# EasyEDA Pro project SAKANA_PCB.epro

# Schematic INA219
Board Name: INA219; Create Date: 2024-12-30; Page Name: P1; Project Name: SAKANA; Schematic Name: INA219; Update Date: 2024-12-30; Company: BSJ INSTRUMENT; Page Size: A5; Version: V1.0
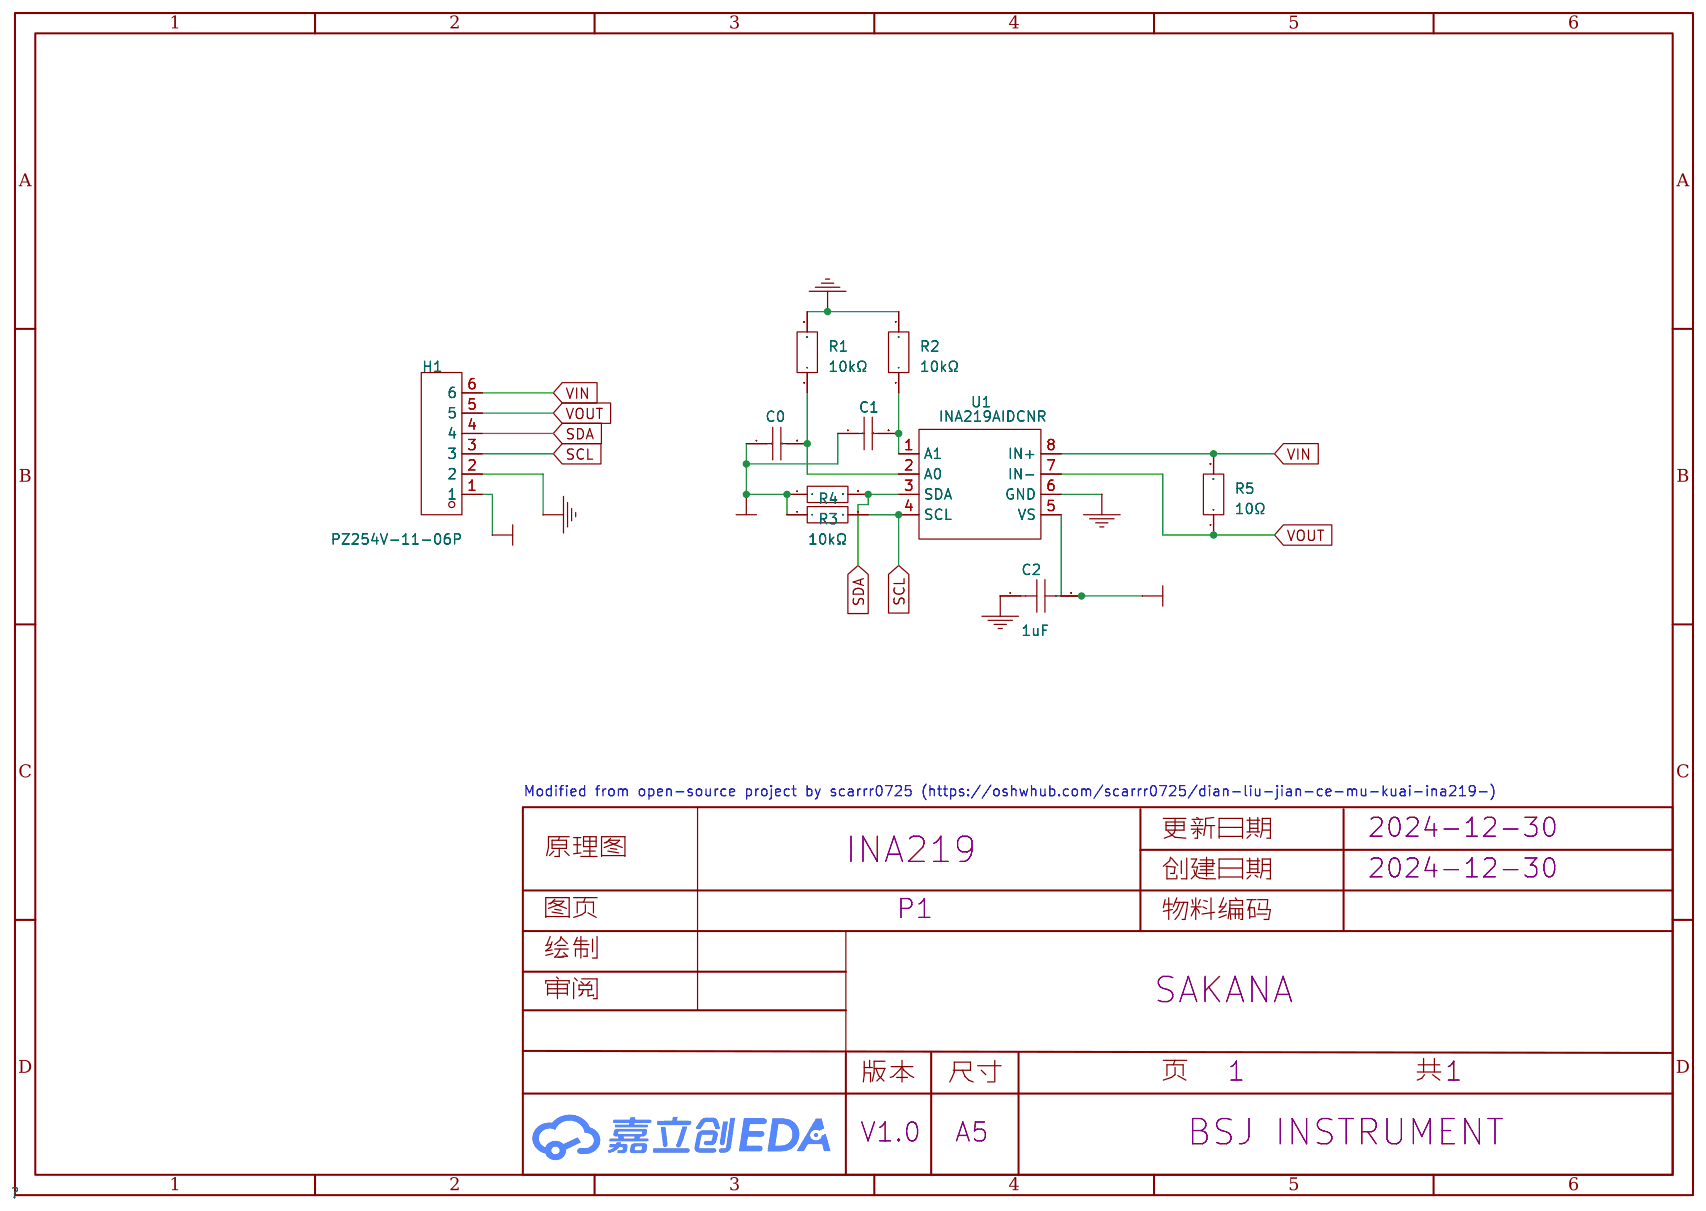
[diagram p0: schematic sheet]

## Parts
C0  1uF  [CAP-TH_L8.5-W5.0-P5.00-D1.2]
C1  1uF  [CAP-TH_L8.5-W5.0-P5.00-D1.2]
C2  1uF  [CAP-TH_L8.5-W5.0-P5.00-D1.2]
H1  PZ254V-11-06P  [HDR-TH_6P-P2.54-V-M]
R1  10kΩ  [RES-TH_BD2.7-L6.2-P10.20-D0.4]
R2  10kΩ  [RES-TH_BD2.7-L6.2-P10.20-D0.4]
R3  10kΩ  [RES-TH_BD2.7-L6.2-P10.20-D0.4]
R4  10K  [RES-TH_BD2.7-L6.2-P10.20-D0.4]
R5  10Ω  [RES-TH_BD2.7-L6.2-P10.20-D0.4]
U1  INA219AIDCNR  [SOIC-8_L4.9-W3.9-P1.27-LS6.0-BL]

## Library data of the parts
C0 C1 = 1uF: Supplier: LCSC; Manufacturer Part: CL10A105KB8NNNC; Manufacturer: SAMSUNG; Supplier Part: C15849; JLCPCB Part Class: Basic
C2 = CT4-0805B104K500F3: 容值:100nF;精度:±10%;额定电压:50V;温度系数:X7R;; LCSC Part Name: 100nF ±10% 50V C3型（直脚）; Supplier Part: C84772; Manufacturer: FH(风华); Supplier Footprint: 插件,P=5.08mm; JLCPCB Part Class: 扩展库; Datasheet: https://atta.szlcsc.com/upload/public/pdf/source/20190402/C385200_059806A6312B28FF1421A2413EB641E1.pdf; Supplier: LCSC; Tolerance: ±10%; Voltage Rated: 50V; Temperature Coefficient: X7R
H1 = PZ254V-11-06P: 插针结构:1x6P;间距:2.54mm;行距:-;圆针/方针:方针;安装类型:直插;排数:单排;总PIN位数:6P;额定电流:-;额定电压:-;配合针长度:6mm;塑高:2.5mm;端接针长度:3mm;触头材质:黄铜;触头镀层:-;工作温度范围:-40℃~+105℃;颜色:黑色;; LCSC Part Name: 间距:2.54mm 1x6P 直插 方针; Supplier Part: C492405; Manufacturer: XFCN(兴飞); Supplier Footprint: 插件,P=2.54mm; JLCPCB Part Class: 扩展库; Datasheet: https://atta.szlcsc.com/upload/public/pdf/source/20200309/C492405_597F1930F5B55CC3C7FD95458F1C3977.pdf; Supplier: LCSC; Pin Structure: 1x6P; Pitch: 2.54mm; Circluar Pins/Square Pins: 方针; Mounting Type: 直插; Number of Rows: 单排; Number of Pins: 6P; Length of Mating Pin: 6mm; Insulation Height: 2.5mm; Length of End Connection Pin: 3mm; Contact Material: 黄铜; Operating Temperature Range: -40℃~+105℃; Color: 黑色
R1 R2 R5 = MF1/4W-1K±1%-ST52: 电阻类型:金属膜电阻;阻值:1kΩ;精度:±1%;功率:250mW;温度系数:±100ppm/℃;; LCSC Part Name: 金属膜电阻 1kΩ ±1% 250mW; Supplier Part: C2903245; Manufacturer: VO(翔胜); Supplier Footprint: 插件,D2.7xL6.2mm; JLCPCB Part Class: 扩展库; Datasheet: https://atta.szlcsc.com/upload/public/pdf/source/20200609/C601728_5AA4C0C8E12E11069DA2C3356F29D1F2.pdf; Supplier: LCSC; Type: 金属膜电阻; Tolerance: ±1%; Overload Voltage (Max): 250V; Power(Watts): 250mW; Temperature Coefficient: ±100ppm/℃; Operating Temperature Range: -55℃~+155℃
R3 R4 = 10K: Supplier: LCSC; Manufacturer Part: TC0325B1002T5E; Manufacturer: UniOhm; Supplier Part: C39050; JLCPCB Part Class: Extend
U1 = INA219AIDCNR: Supplier: LCSC; Manufacturer: TI; Supplier Part: C87469; JLCPCB Part Class: Extend

## Nets
+5V: C0.1 C1.1 C2.2 H1.1 R3.1 R4.1 U1.5(VS)
GND: C2.1 H1.2 R1.2 R2.2 U1.6(GND)
VIN: H1.6 R5.2 U1.8(IN+)
SCL: H1.3 R3.2 U1.4(SCL)
SDA: H1.4 R4.2 U1.3(SDA)
VOUT: H1.5 R5.1 U1.7(IN-)
Net-(C0-2): C0.2 R1.1 U1.2(A0)
Net-(C1-2): C1.2 R2.1 U1.1(A1)

## Notes on the sheet
- Modified from open-source project by scarrr0725 (https://oshwhub.com/scarrr0725/dian-liu-jian-ce-mu-kuai-ina219-)

# Schematic Main
Board Name: Main; Create Date: 2024-12-29; Page Name: P1; Project Name: SAKANA; Schematic Name: Main; Update Date: 2025-02-09; Company: BSJ INSTRUMENT; Page Size: A4; Version: V1.0
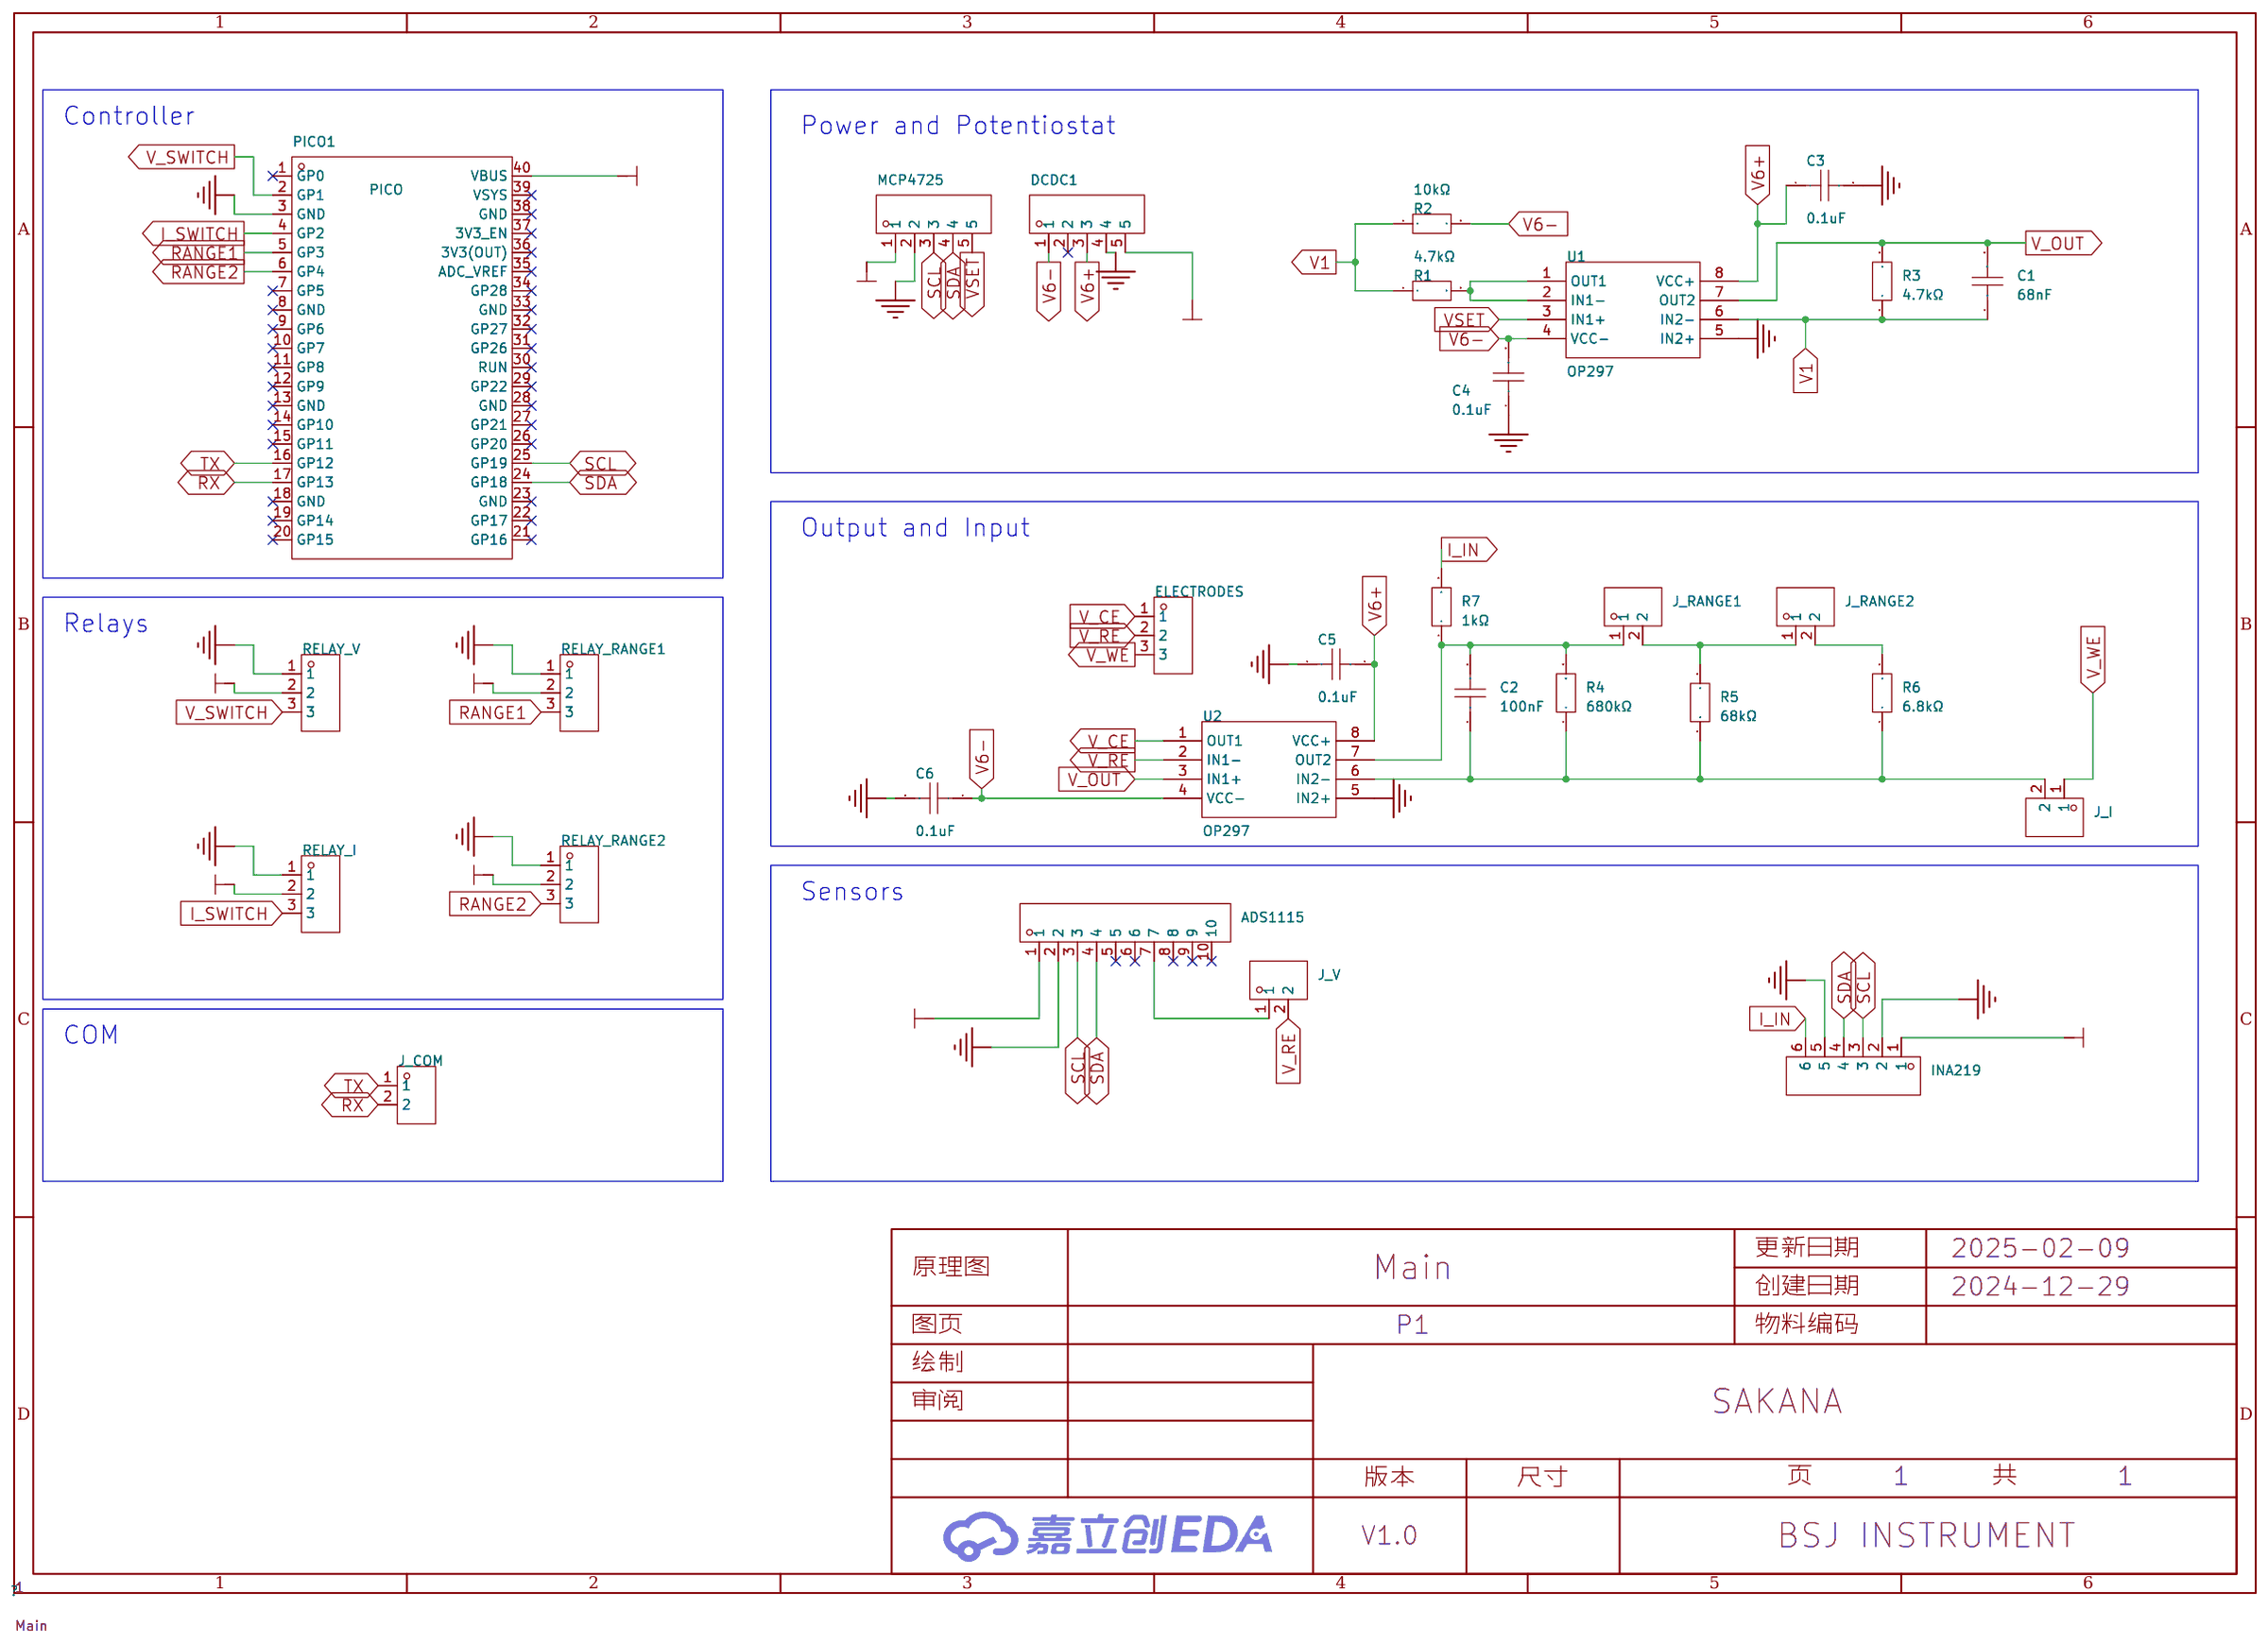
[diagram p1: schematic sheet]

## Parts
ADS1115  HDR1X10  [ADS1115Module]
C1  68nF  [CAP-TH_L10.0-W2.5-P5.15-D0.8]
C2  100nF  [CAP-TH_L10.0-W2.5-P5.15-D0.8]
C3  0.1uF  [CAP-TH_L10.0-W2.5-P5.15-D0.8]
C4  0.1uF  [CAP-TH_L10.0-W2.5-P5.15-D0.8]
C5  0.1uF  [CAP-TH_L10.0-W2.5-P5.15-D0.8]
C6  0.1uF  [CAP-TH_L10.0-W2.5-P5.15-D0.8]
DCDC1  PZ254V-11-05P  [DCDCModule]
ELECTRODES  排母2.54mm 1X3pin  [HDR-TH_3P-P2.54_CS-1165SDIG]
INA219  KH-2.54FH90-1X6P-H8.5  [INA219Module]
J_COM  HDR1X2  [HDR-TH_2P-P2.54-V-M-1]
J_I  HDR1X2  [HDR-TH_2P-P2.54-V-M-1]
J_RANGE1  HDR1X2  [HDR-TH_2P-P2.54-V-M-1]
J_RANGE2  HDR1X2  [HDR-TH_2P-P2.54-V-M-1]
J_V  HDR1X2  [HDR-TH_2P-P2.54-V-M-1]
MCP4725  PZ254V-11-05P  [MCP4725Module]
PICO1  PICO  [PICO直插]
R1  4.7kΩ  [RES-TH_BD2.7-L6.2-P10.20-D0.4]
R2  10kΩ  [RES-TH_BD2.7-L6.2-P10.20-D0.4]
R3  4.7kΩ  [RES-TH_BD2.7-L6.2-P10.20-D0.4]
R4  680kΩ  [RES-TH_BD2.7-L6.2-P10.20-D0.4]
R5  68kΩ  [RES-TH_BD2.7-L6.2-P10.20-D0.4]
R6  6.8kΩ  [RES-TH_BD2.7-L6.2-P10.20-D0.4]
R7  1kΩ  [RES-TH_BD2.7-L6.2-P10.20-D0.4]
RELAY_I  排母2.54mm 1X3pin  [RELAYModule]
RELAY_RANGE1  排母2.54mm 1X3pin  [RELAYModule]
RELAY_RANGE2  排母2.54mm 1X3pin  [RELAYModule]
RELAY_V  排母2.54mm 1X3pin  [RELAYModule]
U1  OP297  [PDIP-8_L9.6-W6.4-P2.54-LS7.6-BL-1]
U2  OP297  [PDIP-8_L9.6-W6.4-P2.54-LS7.6-BL-1]

## Library data of the parts
ADS1115 = HDR1X10: Supplier Part: C9900008052; Supplier Footprint: 1X10P2.54mm塑高3.5mm; JLCPCB Part Class: 扩展库; Supplier: LCSC
C1-C6 = CC1H104ZA1FD3F6C1100: 容值:100nF;精度:-20%~+80%;额定电压:50V;温度系数:Y5V;; LCSC Part Name: 100nF -20%~+80% 50V; Supplier Part: C5442939; Manufacturer: Dersonic(德尔创); Supplier Footprint: 插件,P=2.54mm; JLCPCB Part Class: 扩展库; Datasheet: https://atta.szlcsc.com/upload/public/pdf/source/20240808/2E4F22AECAD8A963CB56DA9A5AABDB6C.pdf; Supplier: LCSC; Tolerance: -20%~+80%; Voltage Rated: 50V; Lead Spacing: 2.54mm; Temperature Coefficient: Y5V; Diameter: 6.3mm; Body Thickness: 2.6mm
DCDC1 MCP4725 = PZ254V-11-05P: 插针结构:1x5P;间距:2.54mm;行距:-;圆针/方针:方针;安装类型:直插;排数:单排;总PIN位数:5P;额定电流:-;额定电压:-;配合针长度:6mm;塑高:2.5mm;端接针长度:3mm;触头材质:黄铜;触头镀层:-;工作温度范围:-40℃~+105℃;颜色:黑色;; LCSC Part Name: 间距:2.54mm 1x5P 直插 方针; Supplier Part: C492404; Manufacturer: XFCN(兴飞); Supplier Footprint: 插件,P=2.54mm; JLCPCB Part Class: 扩展库; Datasheet: https://atta.szlcsc.com/upload/public/pdf/source/20200309/C492404_E51533260F8710EFF5D4617281164C1D.pdf; Supplier: LCSC; Pin Structure: 1x5P; Pitch: 2.54mm; Circluar Pins/Square Pins: 方针; Mounting Type: 直插; Number of Rows: 单排; Number of Pins: 5P; Length of Mating Pin: 6mm; Insulation Height: 2.5mm; Length of End Connection Pin: 3mm; Contact Material: 黄铜; Operating Temperature Range: -40℃~+105℃; Color: 黑色
ELECTRODES RELAY_I RELAY_RANGE1 RELAY_RANGE2 RELAY_V = 排母2.54mm 1X3pin: Supplier Part: C9900016709; JLCPCB Part Class: 扩展库; Supplier: LCSC
INA219 = KH-2.54FH90-1X6P-H8.5: 插孔结构:1x6P;间距:2.54mm;行距:-;圆孔/方孔:方孔;安装类型:弯插;排数:单排;总孔位数:6P;额定电流:3A;额定电压:-;插孔方向:侧面;塑高:8.5mm;工作温度范围:-40℃~+105℃;; LCSC Part Name: 间距:2.54mm 1x6P 弯插; Supplier Part: C2932681; Manufacturer: kinghelm(金航标); Supplier Footprint: 弯插,P=2.54mm; JLCPCB Part Class: 扩展库; Datasheet: https://atta.szlcsc.com/upload/public/pdf/source/20211220/525C1B6496826BAEA2630695935DC58D.pdf; Supplier: LCSC; Holes Structure: 1x6P; Pitch: 2.54mm; Circular Hole / Square Hole: 方孔; Mounting Type: 弯插; Number of Rows: 单排; Number of Holes: 6P; Current Rating (Max): 3A; Holes Direction: 侧面; Insulation Height: 8.5mm; Operating Temperature Range: -40℃~+105℃
J_COM J_I J_RANGE1 J_RANGE2 J_V = HDR1X2: Supplier Part: C9900014921; Supplier Footprint: 排针; JLCPCB Part Class: 扩展库; Supplier: LCSC
PICO1 = PICO: "基于Raspberry Pi RP2040芯片设计；处理器：双核Arm Cortex-M0+ @ 133MHz内存：264KB片上SRAM；2MB板上QSPI闪存接口：26个GPIO引脚，包括3个模拟输入；2 × UART；2 × SPI控制器；2 × I2C控制器；16个PWM通道；1 × USB 1.1控制器和PHY，支持主机和设备；8 × PIO状态机"; Supplier Part: C7203002; Manufacturer: Raspberry Pi(树莓派); JLCPCB Part Class: 扩展库; Datasheet: https://atta.szlcsc.com/upload/public/pdf/source/20230906/086376002DDC9866828648BC93E51F8B.pdf; Supplier: LCSC
R1-R7 = MF1/4W-1K±1%-ST52: 电阻类型:金属膜电阻;阻值:1kΩ;精度:±1%;功率:250mW;温度系数:±100ppm/℃;; LCSC Part Name: 金属膜电阻 1kΩ ±1% 250mW; Supplier Part: C2903245; Manufacturer: VO(翔胜); Supplier Footprint: 插件,D2.7xL6.2mm; JLCPCB Part Class: 扩展库; Datasheet: https://atta.szlcsc.com/upload/public/pdf/source/20200609/C601728_5AA4C0C8E12E11069DA2C3356F29D1F2.pdf; Supplier: LCSC; Type: 金属膜电阻; Tolerance: ±1%; Overload Voltage (Max): 250V; Power(Watts): 250mW; Temperature Coefficient: ±100ppm/℃; Operating Temperature Range: -55℃~+155℃
U1 U2 = NE5532PE4: 放大器数:双路;增益带宽积(GBP):10MHz;输入偏置电流(Ib):200nA;压摆率(SR):9V/us;带宽(-3db):-;; Supplier Part: C1347122; Manufacturer: TI(德州仪器); Supplier Footprint: PDIP-8; JLCPCB Part Class: 扩展库; Datasheet: https://www.ti.com/cn/lit/gpn/sa5532; Supplier: LCSC; Number of Circuits: 双路; Gain Bandwidth Product(GBP): 10MHz; Current - Input Bias(Ib): 200nA; Slew Rate(SR): 9V/us; Output Current: 38mA; Operating Temperature: 0℃~+70℃

## Nets
GND: ADS1115.2 C3.2 C4.1 C5.2 C6.2 DCDC1.4 INA219.2 INA219.5 MCP4725.2 PICO1.3(GND) RELAY_I.1 RELAY_RANGE1.1 RELAY_RANGE2.1 RELAY_V.1 U1.5(IN2+) U2.5(IN2+)
V1: C1.1 R1.1 R2.1 R3.1 U1.6(IN2-)
V6+: C3.1 C5.1 DCDC1.3 U1.8(VCC+) U2.8(VCC+)
V6-: C4.2 C6.1 DCDC1.1 R2.2 U1.4(VCC-) U2.4(VCC-)
VCC: ADS1115.1 DCDC1.5 INA219.1 MCP4725.1 PICO1.40(VBUS) RELAY_I.2 RELAY_RANGE1.2 RELAY_RANGE2.2 RELAY_V.2
I_IN: INA219.6 R7.2
I_SWITCH: PICO1.4(GP2) RELAY_I.3
RANGE1: PICO1.5(GP3) RELAY_RANGE1.3
RANGE2: PICO1.6(GP4) RELAY_RANGE2.3
RX: J_COM.2 PICO1.17(GP13)
SCL: ADS1115.3 INA219.3 MCP4725.3 PICO1.25(GP19)
SDA: ADS1115.4 INA219.4 MCP4725.4 PICO1.24(GP18)
TX: J_COM.1 PICO1.16(GP12)
V_CE: ELECTRODES.1 U2.1(OUT1)
V_OUT: C1.2 R3.2 U1.7(OUT2) U2.3(IN1+)
V_RE: ELECTRODES.2 J_V.2 U2.2(IN1-)
V_SWITCH: PICO1.2(GP1) RELAY_V.3
V_WE: ELECTRODES.3 J_I.1
VSET: MCP4725.5 U1.3(IN1+)
$1N2928: R1.2 U1.1(OUT1) U1.2(IN1-)
$1N3893: C2.1 J_I.2 R4.1 R5.2 R6.1 U2.6(IN2-)
$1N3984: C2.2 J_RANGE1.1 R4.2 R7.1 U2.7(OUT2)
$1N5030: ADS1115.7 J_V.1
$1N11195: J_RANGE1.2 J_RANGE2.1 R5.1
$1N11201: J_RANGE2.2 R6.2

Not connected (* = marked no-connect by the designer): ADS1115 5* 6* 8* 9* 10*; DCDC1 2*; PICO1 1(GP0)* 7(GP5)* 8(GND)* 9(GP6)* 10(GP7)* 11(GP8)* 12(GP9)* 13(GND)* 14(GP10)* 15(GP11)* 18(GND)* 19(GP14)* 20(GP15)* 21(GP16)* 22(GP17)* 23(GND)* 26(GP20)* 27(GP21)* 28(GND)* 29(GP22)* 30(RUN)* 31(GP26)* 32(GP27)* 33(GND)* 34(GP28)* 35(ADC_VREF)* 36(3V3(OUT))* 37(3V3_EN)* 38(GND)* 39(VSYS)*

## Notes on the sheet
- Controller
- Power and Potentiostat
- Output and Input
- Relays
- Sensors
- COM

# Board PCB1_1
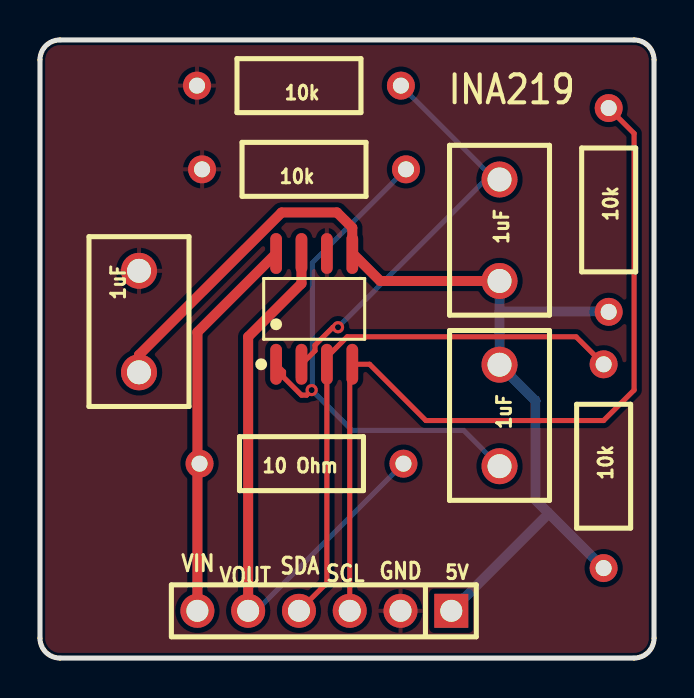
[diagram p2: board, top side]
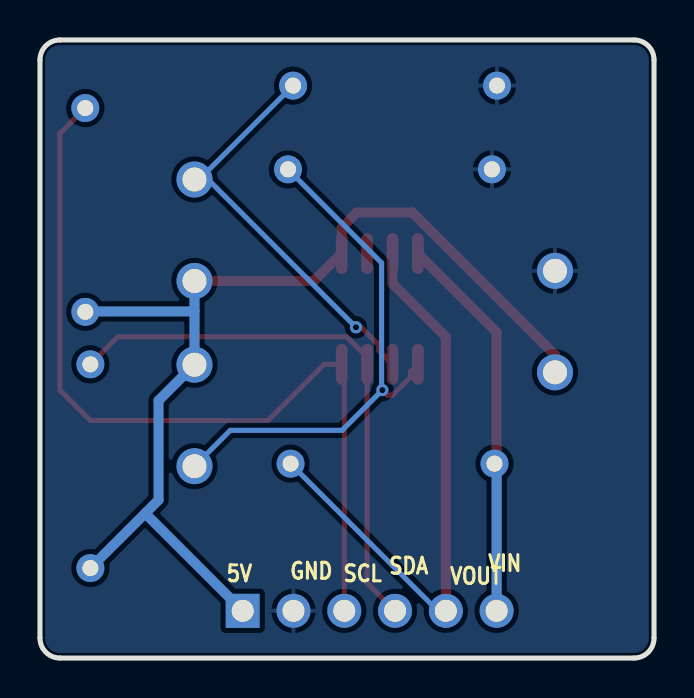
[diagram p3: board, bottom side, seen from below]

Outline 30.72 x 30.94 mm; copper layers: Top Layer, Bottom Layer. Coordinates in mm from the lower left corner of the outline.
Outline path: 0,29.94 0,1 arc(0.29,0.29) 1,0 29.72,0 arc(30.42,0.29) 30.72,1 30.72,29.94 arc(30.42,30.65) 29.72,30.94 1,30.94 arc(0.29,30.65) 0,29.94
Stack: Top Layer 0.035mm / Dielectric1 1.51mm FR4 er 4.5 / Bottom Layer 0.035mm

## Design rules (mm)
template: JLCPCB Capability(Two Layers Board)
spacing copperThickness1oz (default): track to track 0.102, other pairs 0.152 to 0.3
spacing copperThickness2oz: track to track 0.203, other pairs 0.152 to 0.3
track width copperThickness1oz (default): min 0.127, default 0.254, max 2.54
track width copperThickness2oz: min 0.203, default 0.254, max 2.54
differential pair differentialPair (default): width min 0.127, default 0.254, max 2.54; gap min 0.152, default 0.152
via viaSize (default): diameter min 0.5, default 0.61, max 10; hole min 0.3, default 0.305, max 6.3

## Placement (name value [footprint] x y rotation side)
1uF  -  [CAP-TH_L8.5-W5.0-P5.00-D1.2]  22.99 21.41 90 top
1uF#2  -  [CAP-TH_L8.5-W5.0-P5.00-D1.2]  22.99 12.14 270 top
1uF#3  -  [CAP-TH_L8.5-W5.0-P5.00-D1.2]  4.95 16.84 270 top
5V  PZ254V-11-06P  [HDR-TH_6P-P2.54-V-M]  14.22 2.36 180 top
10 Ohm  10Ω  [RES-TH_BD2.7-L6.2-P10.20-D0.4]  13.08 9.73 180 top
10k  -  [RES-TH_BD2.7-L6.2-P10.20-D0.4]  12.95 28.65 180 top
10k#2  -  [RES-TH_BD2.7-L6.2-P10.20-D0.4]  13.21 24.46 180 top
10k#3  -  [RES-TH_BD2.7-L6.2-P10.20-D0.4]  28.45 22.43 90 top
10k#4  -  [RES-TH_BD2.7-L6.2-P10.20-D0.4]  28.19 9.6 90 top
U1  INA219AIDCNR  [SOIC-8_L4.9-W3.9-P1.27-LS6.0-BL]  13.72 17.48 0 top

## Footprints (pads in the part's own frame, mm; a bottom-side part is the same pattern mirrored in y, then rotated)
CAP-TH_L8.5-W5.0-P5.00-D1.2
  round 1.8 hole 1.2: 1(-2.54,0) 2(2.54,0)
HDR-TH_6P-P2.54-V-M
  rect 1.7x1.7 hole 1.1: 1(-6.35,0)
  round 1.7 hole 1.1: 2(-3.81,0) 3(-1.27,0) 4(1.27,0) 5(3.81,0) 6(6.35,0)
RES-TH_BD2.7-L6.2-P10.20-D0.4
  round 1.4 hole 0.8: 1(-5.1,0) 2(5.1,0)
SOIC-8_L4.9-W3.9-P1.27-LS6.0-BL
  oval 0.588x2.045 smd: 1(-1.905,-2.772) 2(-0.635,-2.772) 3(0.635,-2.772) 4(1.905,-2.772) 5(1.905,2.772) 6(0.635,2.772) 7(-0.635,2.772) 8(-1.905,2.772)

## Nets
+5V: 1uF.1 1uF#2.1 1uF#3.2 5V.1 10k#3.1 10k#4.1 U1.5
GND: 1uF#3.1 5V.2 10k.2 10k#2.2 U1.6
VIN: 5V.6 10 Ohm.2 U1.8
SCL: 5V.3 10k#3.2 U1.4
SDA: 5V.4 10k#4.2 U1.3
VOUT: 5V.5 10 Ohm.1 U1.7
$1N4: 1uF#2.2 10k#2.1 U1.1
$1N5: 1uF.2 10k.1 U1.2

## Via types
v1: diameter 0.61, hole 0.305, Top Layer to Bottom Layer, 2 vias

## Routing (per net, layer and track width the routed paths; a pad name or vN(x,y) marks a point on that pad's centre or on a via; arc(x,y) is an arc through that point)
+5V: length 53
  Top Layer w0.5: 1uF#3.2 4.95,15.17 12.09,22.3 14.86,22.3 15.62,21.54 U1.5 15.64,20.25 17.02,18.87 22.99,18.87
  Bottom Layer w0.5: 25.41,7.29 25.41,7.2 5V.1 ; 25.41,7.29 24.78,7.91 24.78,12.89 1uF#2.1 22.99,17.35 ; 25.41,7.29 10k#4.1 ; 22.99,17.35 28.43,17.35 10k#3.1 ; 22.99,17.35 22.99,18.87
VIN: length 26.9
  Top Layer w0.5: U1.8 7.87,16.31 5V.6
  Bottom Layer w0.5: 5V.6 7.87,9.62 10 Ohm.2
SCL: length 42.9
  Top Layer w0.254: 10k#3.2 29.72,26.26 29.72,13.41 28.19,11.89 19.3,11.89 16.49,14.7 U1.4 15.49,14.58 5V.3
SDA: length 28.1
  Top Layer w0.254: 10k#4.2 26.82,16.08 15.37,16.08 14.35,15.06 U1.3 14.35,3.76 5V.4
VOUT: length 29.8
  Top Layer w0.5: 13.08,20.25 13.08,18.75 10.41,16.08 5V.5
  Bottom Layer w0.254: 5V.5 10.81,2.36 10 Ohm.1
$1N4: length 26.7
  Top Layer w0.254: v1(13.59,13.41) 13.34,13.16 13.08,13.16 12.18,14.06 12.18,14.33 U1.1
  Bottom Layer w0.254: 10k#2.1 13.63,19.78 13.63,13.37 ; 13.63,13.37 v1(13.59,13.41) ; 13.63,13.37 15.6,11.4 21.19,11.4 1uF#2.2
$1N5: length 20.4
  Top Layer w0.254: 13.08,14.7 13.76,15.38 13.76,15.66 14.65,16.56 v1(14.91,16.56)
  Bottom Layer w0.254: 1uF.2 22.75,23.95 22.53,24.18 ; 22.53,24.18 v1(14.91,16.56) ; 22.53,24.18 10k.1

## Copper pours and planes (outline as drawn; the poured copper is in the pictures)
GND on Top Layer: -1.27,32.46 32.13,32.46 32.13,-1.19 -1.27,-1.19
GND on Bottom Layer: -2.16,33.1 32.64,33.1 32.64,-2.21 -2.16,-2.21

## Text on the board
Bottom Silkscreen Layer: VIN | VOUT | SDA | SCL | GND | 5V
Top Silkscreen Layer: VIN | VOUT | SDA | SCL | GND | INA219

# Board PCB1
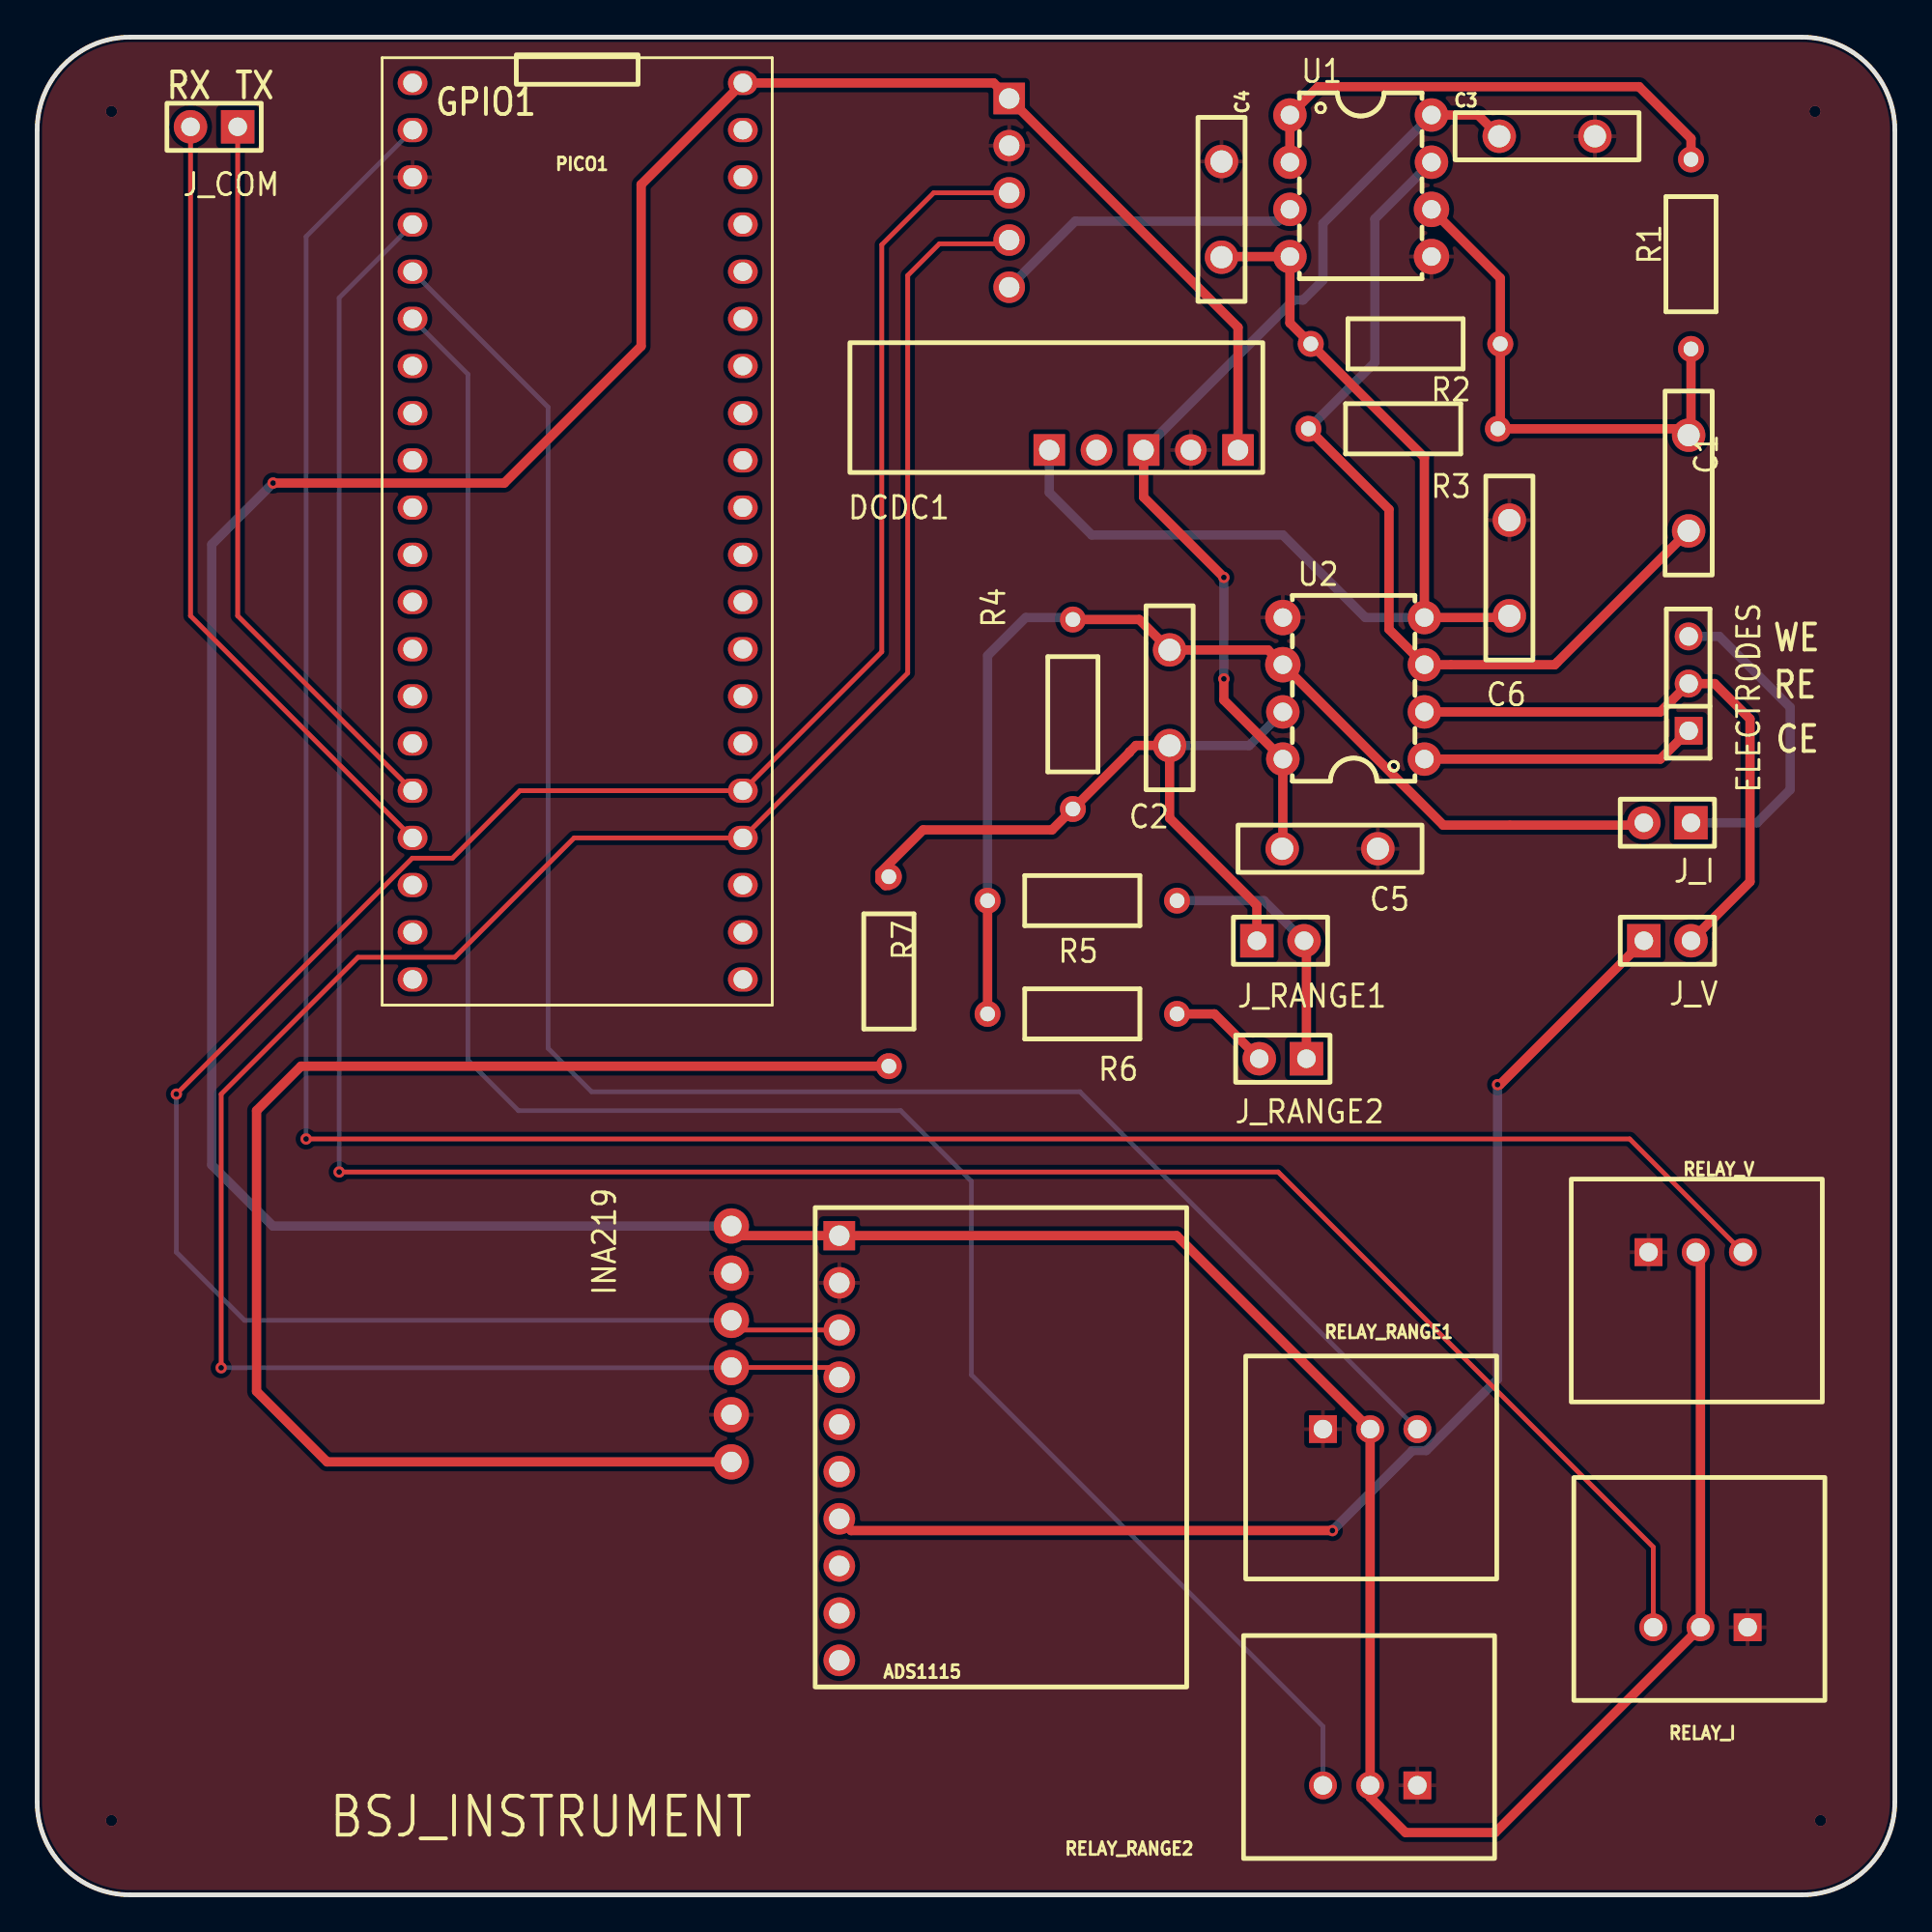
[diagram p4: board, top side]
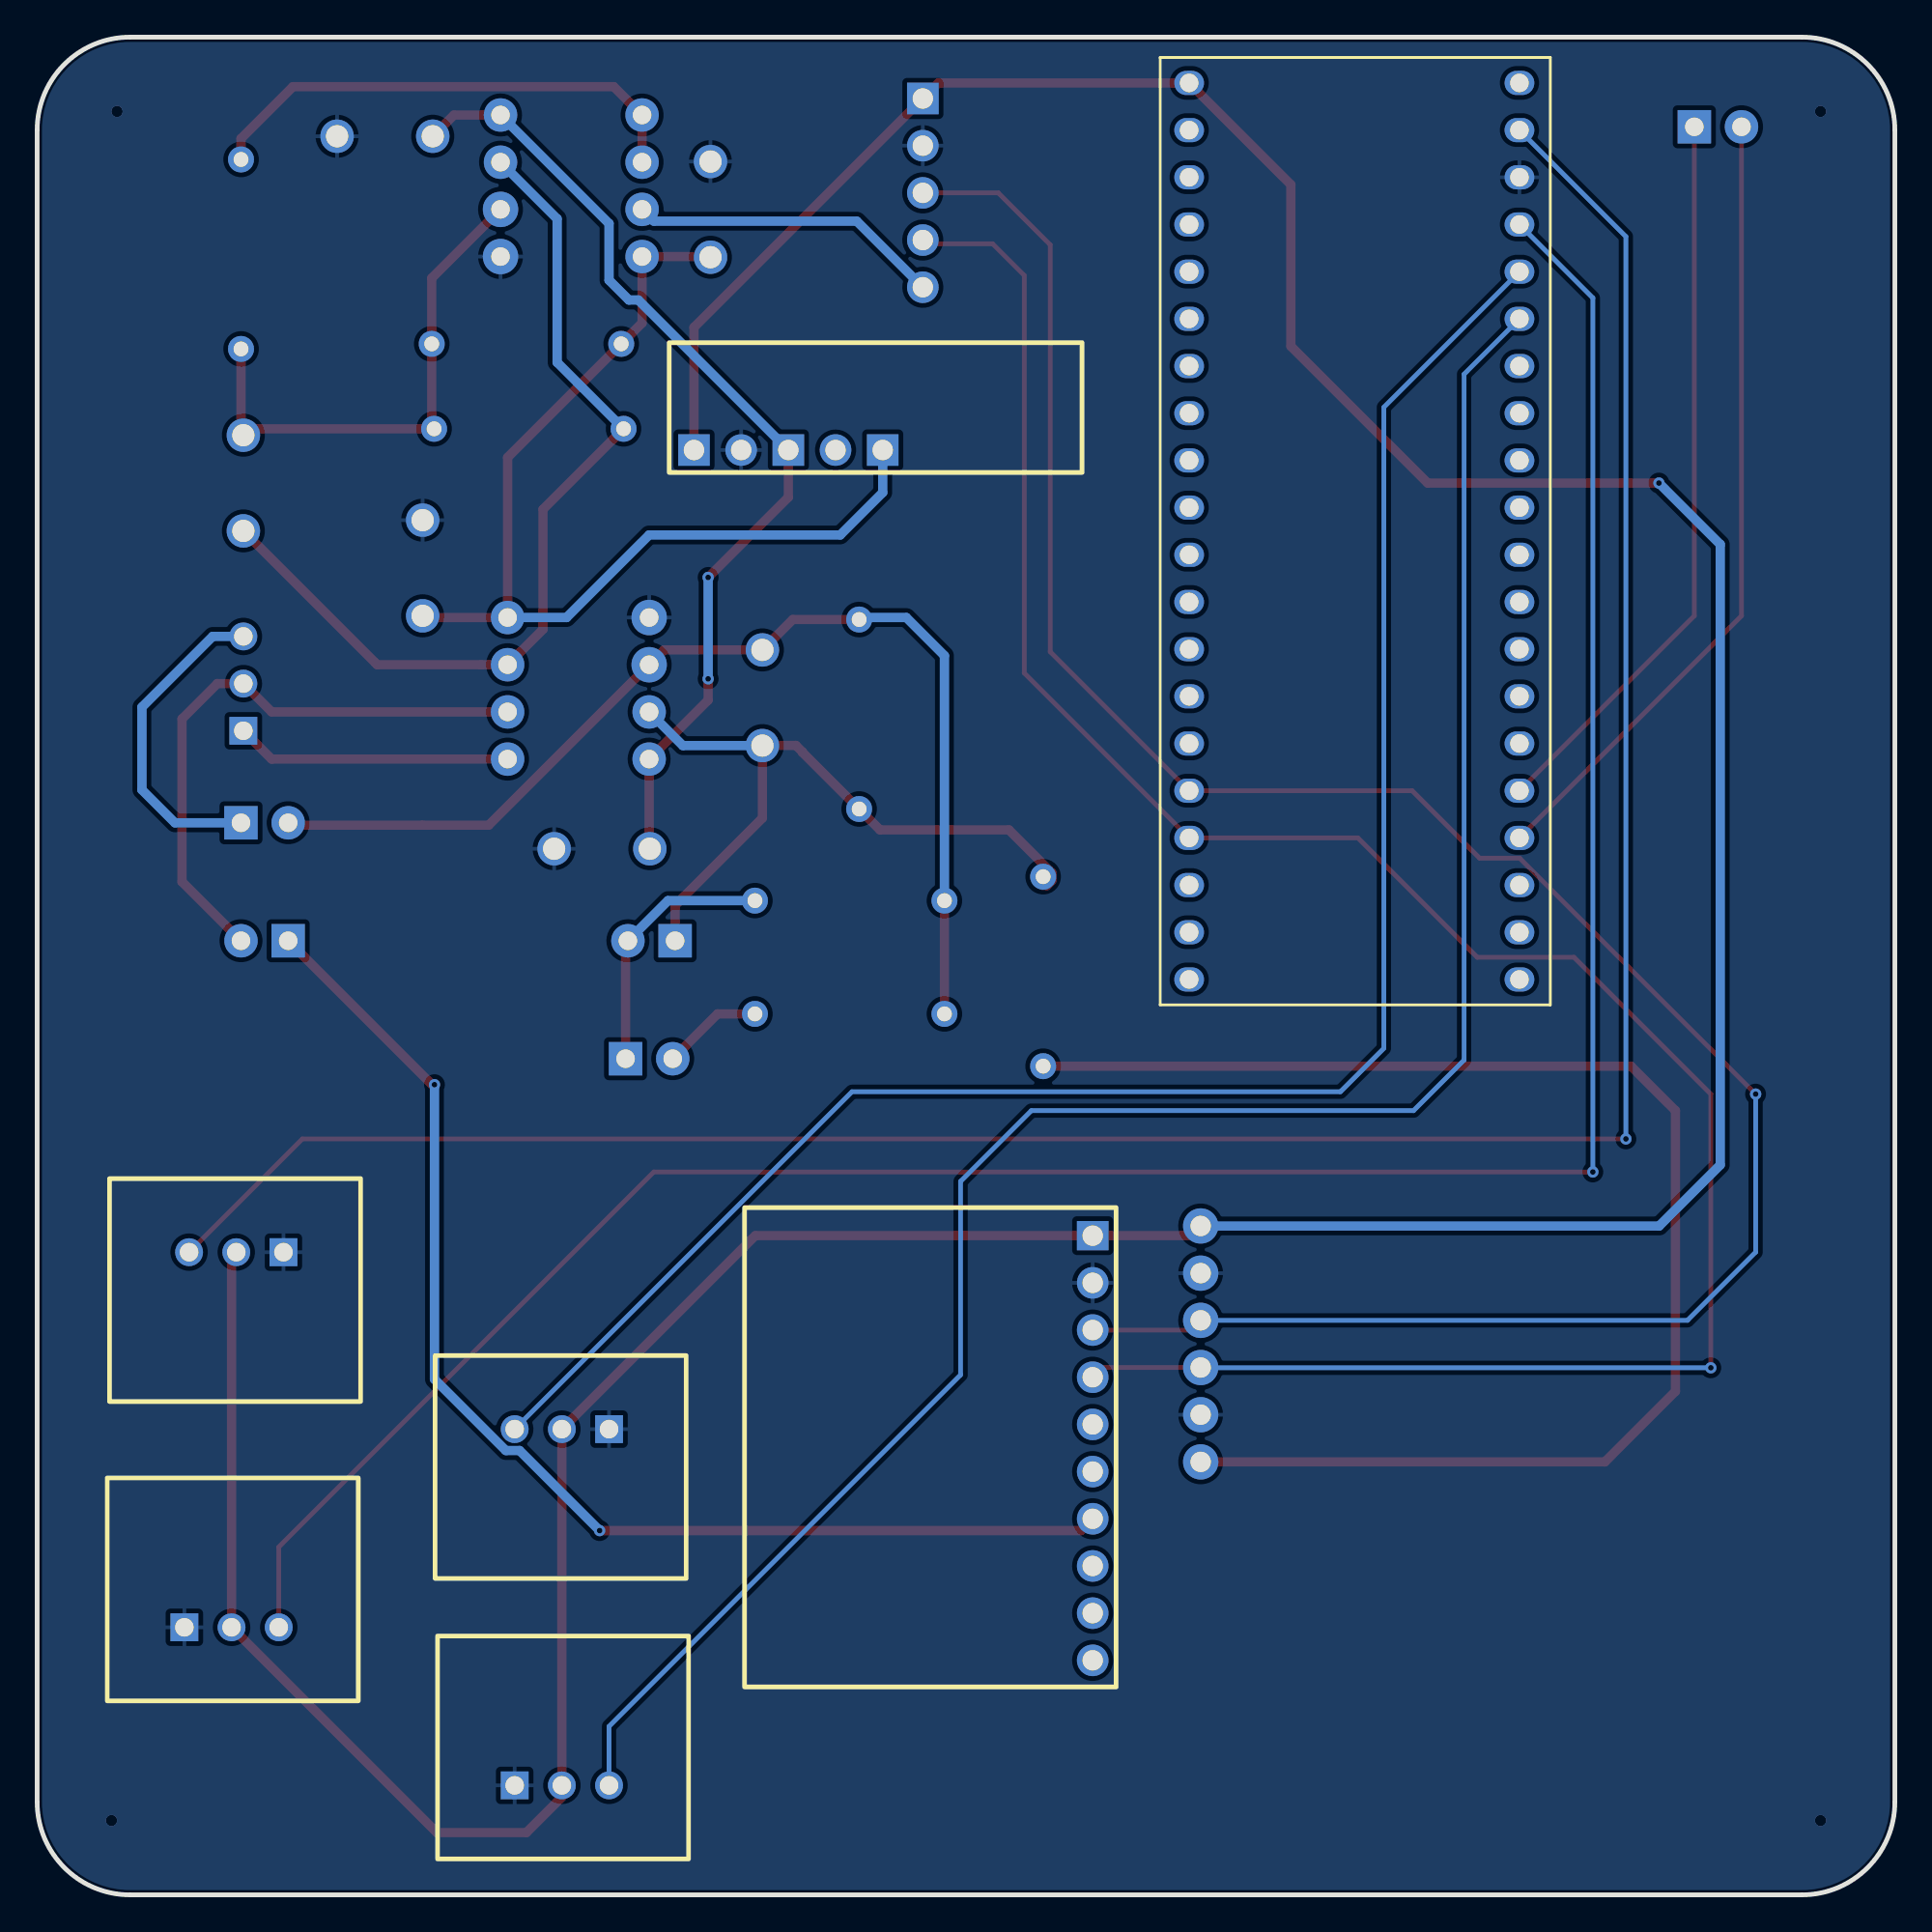
[diagram p5: board, bottom side, seen from below]

Outline 100 x 100 mm; copper layers: Top Layer, Bottom Layer. Coordinates in mm from the lower left corner of the outline.
Outline path: 0,95 0,5 arc(1.46,1.46) 5,0 95,0 arc(98.54,1.46) 100,5 100,95 arc(98.54,98.54) 95,100 5,100 arc(1.46,98.54) 0,95
Stack: Top Layer 0.035mm / Dielectric1 1.51mm FR4 er 4.5 / Bottom Layer 0.035mm

## Design rules (mm)
template: JLCPCB Capability(Two Layers Board)
spacing copperThickness1oz (default): track to track 0.102, other pairs 0.152 to 0.3
spacing copperThickness2oz: track to track 0.203, other pairs 0.152 to 0.3
track width copperThickness1oz (default): min 0.127, default 0.254, max 2.54
track width copperThickness2oz: min 0.203, default 0.254, max 2.54
differential pair differentialPair (default): width min 0.127, default 0.254, max 2.54; gap min 0.152, default 0.152
via viaSize (default): diameter min 0.5, default 0.61, max 10; hole min 0.3, default 0.305, max 6.3

## Placement (name value [footprint] x y rotation side)
ADS1115  HDR1X10  [ADS1115Module]  43.18 24.05 270 top
C1  68nF  [CAP-TH_L10.0-W2.5-P5.15-D0.8]  88.9 76 270 top
C2  100nF  [CAP-TH_L10.0-W2.5-P5.15-D0.8]  60.96 64.44 270 top
C3  0.1uF  [CAP-TH_L10.0-W2.5-P5.15-D0.8]  81.28 94.67 0 top
C4  0.1uF  [CAP-TH_L10.0-W2.5-P5.15-D0.8]  63.75 90.73 270 top
C5  0.1uF  [CAP-TH_L10.0-W2.5-P5.15-D0.8]  69.6 56.31 0 top
C6  0.1uF  [CAP-TH_L10.0-W2.5-P5.15-D0.8]  79.25 71.42 90 top
DCDC1  PZ254V-11-05P  [DCDCModule]  59.56 77.78 0 top
ELECTRODES  排母2.54mm 1X3pin  [HDR-TH_3P-P2.54_CS-1165SDIG]  88.9 65.2 90 top
INA219  KH-2.54FH90-1X6P-H8.5  [INA219Module]  38.86 46.41 270 top
J_COM  HDR1X2  [HDR-TH_2P-P2.54-V-M-1]  9.53 95.17 180 top
J_I  HDR1X2  [HDR-TH_2P-P2.54-V-M-1]  87.76 57.71 180 top
J_RANGE1  HDR1X2  [HDR-TH_2P-P2.54-V-M-1]  66.93 51.36 0 top
J_RANGE2  HDR1X2  [HDR-TH_2P-P2.54-V-M-1]  67.06 45.01 180 top
J_V  HDR1X2  [HDR-TH_2P-P2.54-V-M-1]  87.76 51.36 0 top
MCP4725  PZ254V-11-05P  [MCP4725Module]  52.32 91.62 270 top
PICO1  PICO  [PICO直插]  28.96 80.7 270 top
R1  4.7kΩ  [RES-TH_BD2.7-L6.2-P10.20-D0.4]  89.03 88.32 90 top
R2  10kΩ  [RES-TH_BD2.7-L6.2-P10.20-D0.4]  73.66 83.49 180 top
R3  4.7kΩ  [RES-TH_BD2.7-L6.2-P10.20-D0.4]  73.53 78.92 180 top
R4  680kΩ  [RES-TH_BD2.7-L6.2-P10.20-D0.4]  55.75 63.55 270 top
R5  68kΩ  [RES-TH_BD2.7-L6.2-P10.20-D0.4]  56.26 53.52 180 top
R6  6.8kΩ  [RES-TH_BD2.7-L6.2-P10.20-D0.4]  56.26 47.42 0 top
R7  1kΩ  [RES-TH_BD2.7-L6.2-P10.20-D0.4]  45.85 49.71 270 top
RELAY_I  排母2.54mm 1X3pin  [RELAYModule]  89.53 14.4 180 top
RELAY_RANGE1  排母2.54mm 1X3pin  [RELAYModule]  71.75 25.07 0 top
RELAY_RANGE2  排母2.54mm 1X3pin  [RELAYModule]  71.75 5.89 180 top
RELAY_V  排母2.54mm 1X3pin  [RELAYModule]  89.28 34.59 0 top
U1  OP297  [PDIP-8_L9.6-W6.4-P2.54-LS7.6-BL-1]  71.25 92 270 top
U2  OP297  [PDIP-8_L9.6-W6.4-P2.54-LS7.6-BL-1]  70.87 64.95 90 top

## Footprints (pads in the part's own frame, mm; a bottom-side part is the same pattern mirrored in y, then rotated)
ADS1115Module
  rect 1.575x1.7 hole 1.1: 1(-11.43,0)
  round 1.7 hole 1.1: 2(-8.89,0) 3(-6.35,0) 4(-3.81,0) 5(-1.27,0) 6(1.27,0) 7(3.81,0) 8(6.35,0) 9(8.89,0) 10(11.43,0)
CAP-TH_L10.0-W2.5-P5.15-D0.8
  round 1.8 hole 1.2: 1(-2.575,0) 2(2.575,0)
DCDCModule
  rect 1.7x1.7 hole 1.1: 1(-5.08,0) 3(0,0) 5(5.08,0)
  round 1.7 hole 1.1: 2(-2.54,0) 4(2.54,0)
HDR-TH_2P-P2.54-V-M-1
  rect 1.8x1.8 hole 1: 1(-1.27,0)
  round 1.8 hole 1: 2(1.27,0)
HDR-TH_3P-P2.54_CS-1165SDIG
  rect 1.5x1.5 hole 1: 1(-2.54,0)
  round 1.5 hole 1: 2(0,0) 3(2.54,0)
INA219Module
  round 1.9 hole 1.1: 1(10.4,-1.494) 2(12.94,-1.494) 3(15.48,-1.494) 4(18.02,-1.494) 5(20.56,-1.494) 6(23.1,-1.494)
MCP4725Module
  rect 1.7x1.7 hole 1.1: 1(-5.08,0)
  round 1.7 hole 1.1: 2(-2.54,0) 3(0,0) 4(2.54,0) 5(5.08,0)
PDIP-8_L9.6-W6.4-P2.54-LS7.6-BL-1
  round 1.8 hole 1: 1(-3.81,-3.81) 2(-1.27,-3.81) 3(1.27,-3.81) 4(3.81,-3.81) 7(-1.27,3.81) 8(-3.81,3.81)
  round 1.905 hole 1: 5(3.81,3.81) 6(1.27,3.81)
PICO直插
  oval 1.3x1.6 hole 1: 1(-16.84,-8.748) 2(-14.3,-8.748) 3(-11.76,-8.748) 4(-9.22,-8.748) 5(-6.68,-8.748) 6(-4.14,-8.748) 7(-1.6,-8.748) 8(0.94,-8.748) 9(3.48,-8.748) 10(6.02,-8.748) 11(8.56,-8.748) 12(11.1,-8.748) 13(13.64,-8.748) 14(16.18,-8.748) 15(18.72,-8.748) 16(21.26,-8.748) 17(23.8,-8.748) 18(26.34,-8.748) 19(28.88,-8.748) 20(31.42,-8.748) 21(31.42,9.032) 22(28.88,9.032) 23(26.34,9.032) 24(23.8,9.032) 25(21.26,9.032) 26(18.72,9.032) 27(16.18,9.032) 28(13.64,9.032) 29(11.1,9.032) 30(8.56,9.032) 31(6.02,9.032) 32(3.48,9.032) 33(0.94,9.032) 34(-1.6,9.032) 35(-4.14,9.032) 36(-6.68,9.032) 37(-9.22,9.032) 38(-11.76,9.032) 39(-14.3,9.032) 40(-16.84,9.032)
RELAYModule
  rect 1.5x1.5 hole 1: 1(-2.54,0)
  round 1.5 hole 1: 2(0,0) 3(2.54,0)
RES-TH_BD2.7-L6.2-P10.20-D0.4
  round 1.4 hole 0.8: 1(-5.1,0) 2(5.1,0)

## Nets
As in the schematic.

Pads without a net: ADS1115 5 6 8 9 10; DCDC1 2; PICO1 1 7 8 9 10 11 12 13 14 15 18 19 20 21 22 23 26 27 28 29 30 31 32 33 34 35 36 37 38 39

## Via types
v1: diameter 0.61, hole 0.305, Top Layer to Bottom Layer, 9 vias
v2: diameter 0.61, hole 4, Top Layer to Bottom Layer, 4 vias

## Routing (per net, layer and track width the routed paths; a pad name or vN(x,y) marks a point on that pad's centre or on a via; arc(x,y) is an arc through that point)
GND:
  vias: v2(4,96) v2(4,4) v2(95.7,96) v2(96,4)
V1: length 28.5
  Top Layer w0.5: R1.1 89.03,78.7 C1.1 88.55,78.92 R3.1 78.76,79.05 R2.1 78.76,87.03 75.06,90.73
V6+: length 53.5
  Top Layer w0.5: 75.06,95.81 77.56,95.81 C3.1 ; v1(63.88,65.46) 63.88,64.31 U2.8 67.06,56.35 67.02,56.31 ; DCDC1.3 59.56,75.23 v1(63.88,70.92)
  Bottom Layer w0.5: v1(63.88,65.46) v1(63.88,70.92) ; DCDC1.3 67.64,85.85 68.15,85.85 69.22,86.92 69.22,89.97 75.06,95.81
V6-: length 56
  Top Layer w0.5: C4.2 63.79,88.19 U1.4 67.44,84.61 R2.2 74.68,77.37 U2.4 79.16,68.76 C6.1
  Bottom Layer w0.5: 54.48,77.78 54.48,75.49 56.77,73.2 67.06,73.2 71.5,68.76 U2.4
VCC: length 247.6
  Top Layer w0.5: DCDC1.5 64.64,84.38 MCP4725.1 51.49,97.54 PICO1.40 32.51,92.06 32.51,83.36 25.15,76 v1(12.7,76) ; RELAY_V.2 89.53,34.34 RELAY_I.2 78.49,3.35 73.66,3.35 71.75,5.26 RELAY_RANGE2.2 RELAY_RANGE1.2 61.34,35.48 ADS1115.1 37.89,35.48 INA219.1
  Bottom Layer w0.5: INA219.1 12.69,36.01 9.4,39.29 9.4,72.69 v1(12.7,76)
I_IN: length 77.3
  Top Layer w0.5: R7.2 14.2,44.61 11.81,42.22 11.81,27.1 15.61,23.31 INA219.6
I_SWITCH: length 136.1
  Top Layer w0.254: RELAY_I.3 87,18.72 66.8,38.91 v1(16.26,38.91)
  Bottom Layer w0.254: v1(16.26,38.91) 16.26,85.96 PICO1.4
RANGE1: length 100.1
  Bottom Layer w0.254: RELAY_RANGE1.3 56.13,43.23 29.84,43.23 27.51,45.57 27.51,80.08 PICO1.5
RANGE2: length 111.3
  Bottom Layer w0.254: PICO1.6 23.19,81.86 23.19,44.93 25.91,42.22 46.48,42.22 50.29,38.41 50.29,27.99 69.22,9.07 RELAY_RANGE2.3
RX: length 43.2
  Top Layer w0.254: J_COM.2 8.25,68.85 PICO1.17
SCL: length 123.7
  Top Layer w0.254: INA219.3 37.89,30.4 ADS1115.3 ; v1(7.49,43.1) 20.19,55.8 22.35,55.8 25.98,59.44 PICO1.25 45.47,66.91 45.47,88.82 48.26,91.62 MCP4725.3
  Bottom Layer w0.254: INA219.3 11.16,30.93 7.49,34.59 v1(7.49,43.1)
SDA: length 122.2
  Top Layer w0.254: v1(9.91,28.37) 9.91,43.1 17.27,50.47 22.48,50.47 28.91,56.9 PICO1.24 46.86,65.77 46.86,87.17 48.57,88.88 52.12,88.88 MCP4725.4 ; ADS1115.4 42.66,28.39 INA219.4
  Bottom Layer w0.254: v1(9.91,28.37) 37.35,28.37 INA219.4
TX: length 39.6
  Top Layer w0.254: PICO1.16 10.8,68.85 J_COM.1
V_CE: length 14.9
  Top Layer w0.5: U2.1 87.38,61.14 ELECTRODES.1
V_OUT: length 49.6
  Top Layer w0.5: R3.2 72.77,74.58 72.77,68.12 U2.3 81.7,66.22 C1.2
  Bottom Layer w0.5: 75.06,93.27 72.01,90.22 72.01,82.49 R3.2
V_RE: length 32.2
  Top Layer w0.5: U2.2 87.38,63.68 ELECTRODES.2 90.3,65.2 92.2,63.3 92.2,54.53 J_V.2
V_SWITCH: length 136.5
  Top Layer w0.254: v1(14.48,40.69) 85.72,40.69 RELAY_V.3
  Bottom Layer w0.254: v1(14.48,40.69) 14.48,89.27 PICO1.2
V_WE: length 17.6
  Bottom Layer w0.5: ELECTRODES.3 90.55,67.74 94.36,63.93 94.36,59.49 92.58,57.71 J_I.1
VSET: length 16.8
  Bottom Layer w0.5: MCP4725.5 55.88,90.09 66.8,90.09 U1.3
$1N2928: length 27
  Top Layer w0.5: R1.2 89.03,94.54 86.23,97.33 68.96,97.33 U1.1 U1.2
$1N3893: length 60.1
  Top Layer w0.5: R4.1 59.32,68.65 C2.1 66.26,67.02 U2.6 75.69,57.58 86.36,57.58 J_I.2 ; R5.2 R6.1
  Bottom Layer w0.5: R4.1 55.65,68.76 53.21,68.76 51.16,66.71 R5.2
$1N3984: length 38.7
  Top Layer w0.5: 45.85,54.33 45.65,54.33 45.37,54.61 45.37,55.01 47.69,57.33 54.63,57.33 R4.2 58.8,61.5 58.8,61.52 59.15,61.87 60.95,61.87 C2.2 60.96,57.96 65.66,53.26 J_RANGE1.1
  Bottom Layer w0.5: U2.7 65.24,61.86 C2.2
$1N5030: length 66
  Top Layer w0.5: ADS1115.7 43.81,19.61 v1(69.72,19.61) ; v1(78.61,43.61) 78.74,43.61 J_V.1
  Bottom Layer w0.5: v1(78.61,43.61) 78.61,27.76 74.77,23.92 74.03,23.92 v1(69.72,19.61)
$1N11195: length 14.1
  Top Layer w0.5: J_RANGE2.1 68.33,51.23 J_RANGE1.2
  Bottom Layer w0.5: J_RANGE1.2 66.04,53.52 R5.1
$1N11201: length 5.4
  Top Layer w0.5: J_RANGE2.2 63.37,47.42 R6.2

## Copper pours and planes (outline as drawn; the poured copper is in the pictures)
GND on Top Layer: -7.62,103.56 108.71,103.56 108.71,-4.78 -7.62,-4.78
GND on Bottom Layer: -7.37,103.56 107.44,103.56 107.44,-4.01 -7.37,-4.01

## Text on the board
Top Silkscreen Layer: RX | TX | GPIO1 | WE | RE | CE | BSJ_INSTRUMENT
